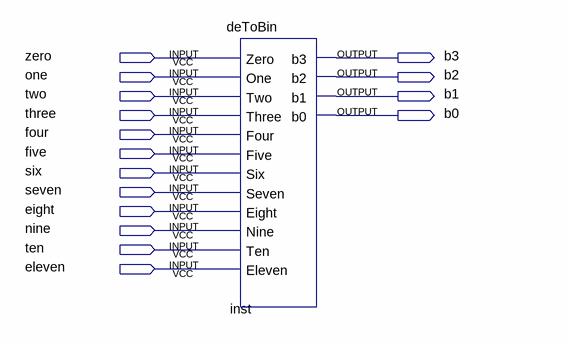
[diagram p0: schematic sheet]
// Quartus schematic deToBin_Symbol.bdf as structural Verilog: 1 symbols, 16 pins
module deToBin_Symbol (
  input  zero,
  input  one,
  input  two,
  input  three,
  input  four,
  input  five,
  input  six,
  input  seven,
  input  eight,
  input  nine,
  input  ten,
  input  eleven,
  output b3,
  output b2,
  output b1,
  output b0
);

  deToBin inst (
    .Zero(zero), .One(one), .Two(two), .Three(three), .Four(four), .Five(five), .Six(six), .Seven(seven),
    .Eight(eight), .Nine(nine), .Ten(ten), .Eleven(eleven), .b3(b3), .b2(b2), .b1(b1), .b0(b0));
endmodule
